# Altium schematic sheet Motor_ESC.SchDoc
size A4; SheetNumber: 10; SheetTotal: 10
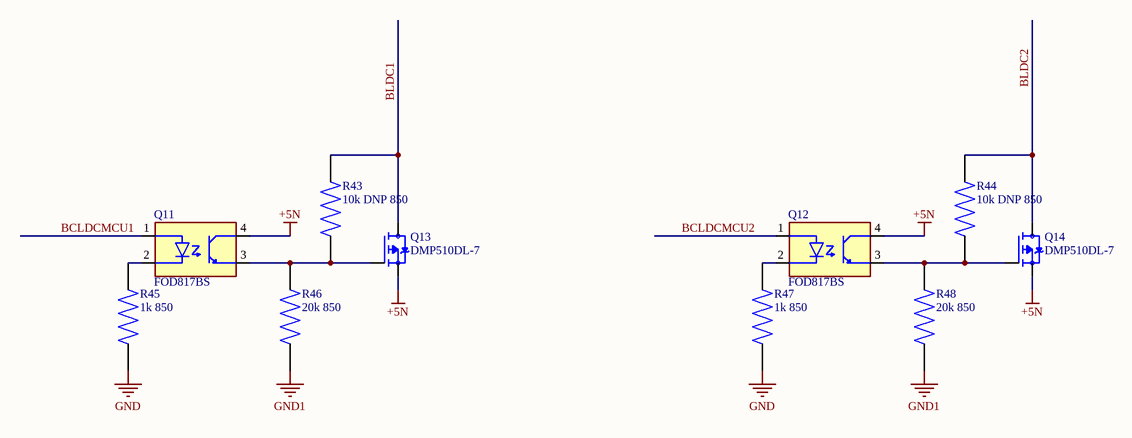
[diagram p0: Motor_ESC.SchDoc]

## Parts
Q11  FOD817BS  [SOIC254P1016X385-4N]
Q12  FOD817BS  [SOIC254P1016X385-4N]
Q13  DMP510DL-7  [SOT91P240X110-3N - duplicate]
Q14  DMP510DL-7  [SOT91P240X110-3N - duplicate]
R43  10k DNP 850  [10k 850]
R44  10k DNP 850  [10k 850]
R45  1k 850  [10k 850]
R46  20k 850  [10k 850]
R47  1k 850  [10k 850]
R48  20k 850  [10k 850]

## Nets
+5N: Q11.4(COLLECTOR) Q12.4(COLLECTOR) Q13.2(S) Q14.2(S)
GND: R45.2 R47.2
GND1: R46.2 R48.2
BCLDCMCU1: Q11.1(ANODE)
BCLDCMCU2: Q12.1(ANODE)
BLDC1: Q13.3(D) R43.1
BLDC2: Q14.3(D) R44.1
NetQ11_2: Q11.2(CATHODE) R45.1
NetQ11_3: Q11.3(EMITTER) Q13.1(G) R43.2 R46.1
NetQ12_2: Q12.2(CATHODE) R47.1
NetQ12_3: Q12.3(EMITTER) Q14.1(G) R44.2 R48.1

## Library data of the parts
Q11 Q12 = FOD817BS: Transistor Output Optocouplers Opto Phototransistor Output SM-DIP4; MF: ON Semiconductor; SnapEDA_Link: https://www.snapeda.com/parts/FOD817BS/Onsemi/view-part/?ref=snap; Package: SMD-4 ON Semiconductor; Value: *; MP: FOD817BS; Check_prices: https://www.snapeda.com/parts/FOD817BS/Onsemi/view-part/?ref=eda
R43-R48 = 10k 850